# EAGLE design analog-daughter-as-built (EAGLE 6.6.0)
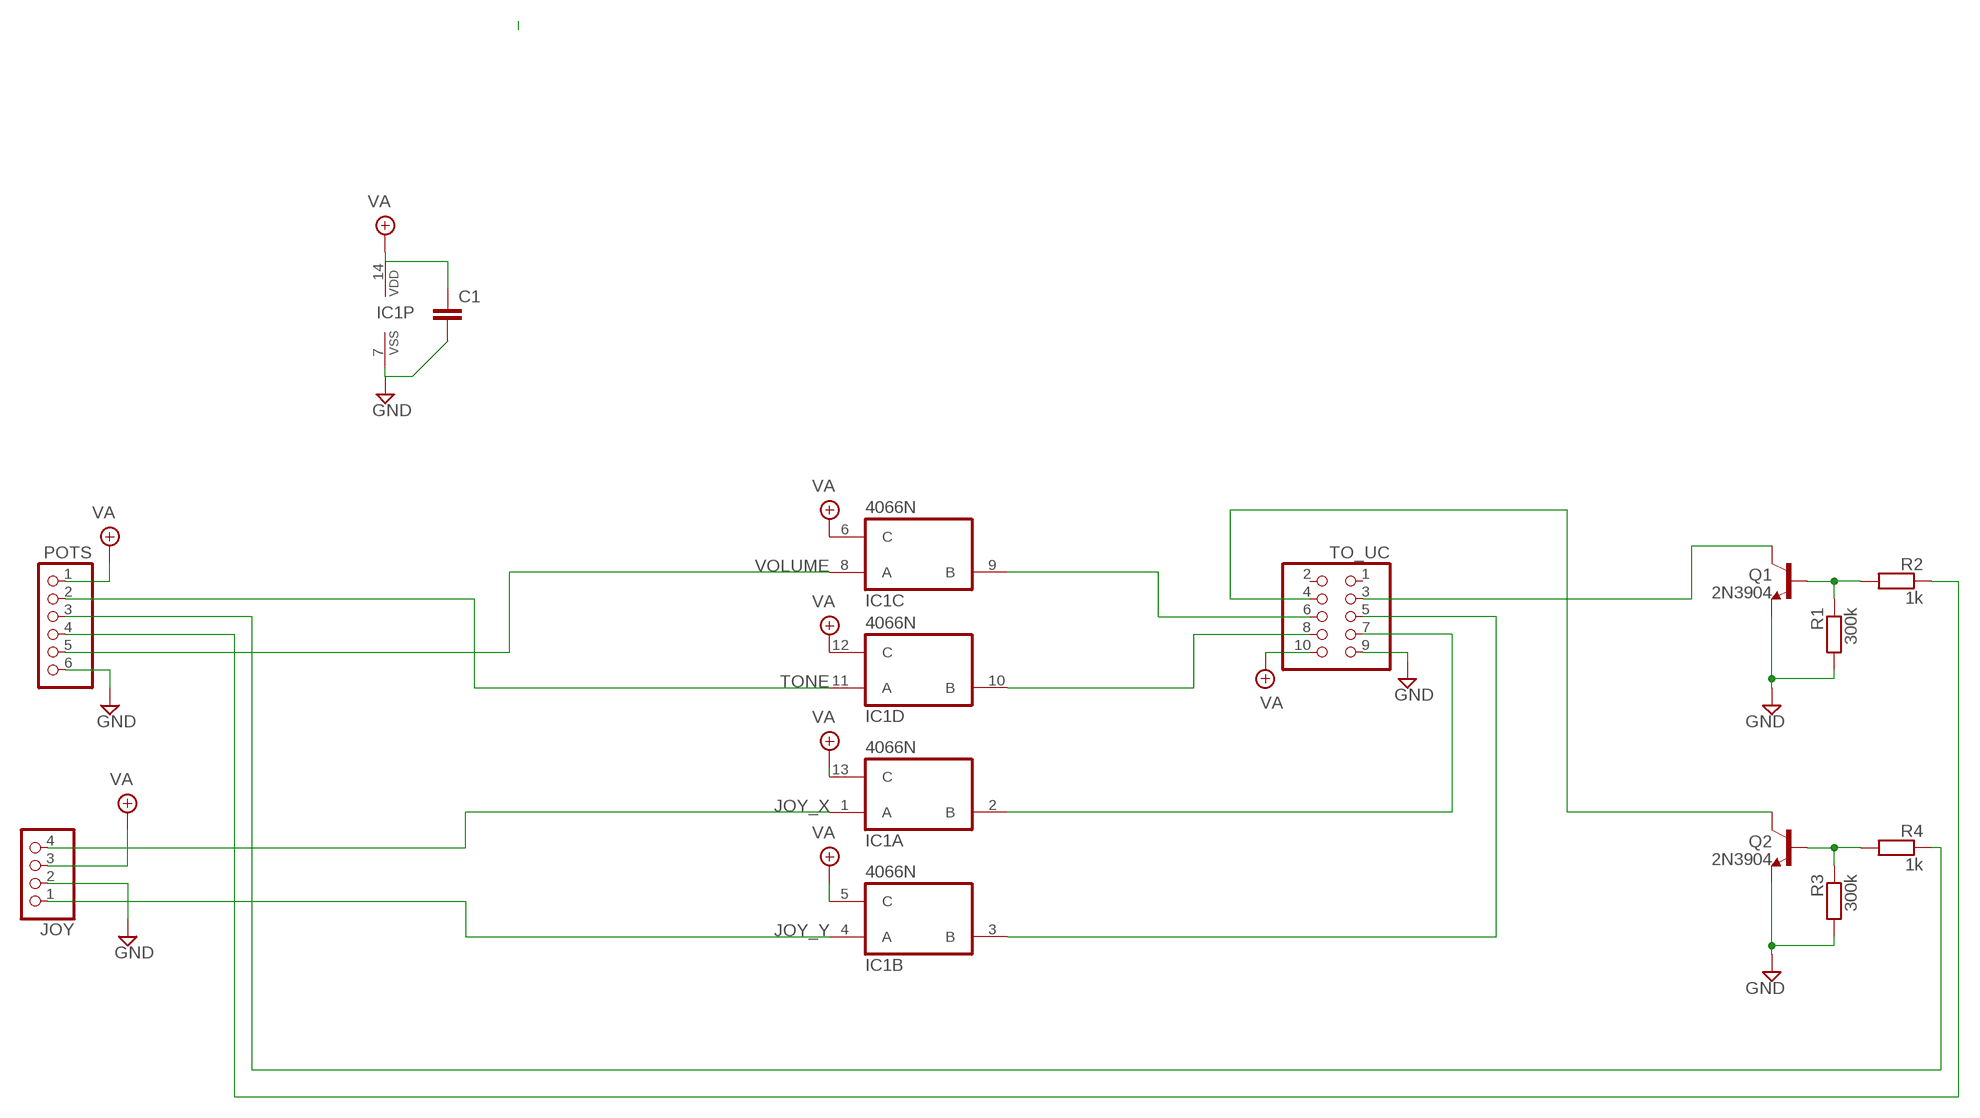
[diagram p0: schematic, sheet 1]

## Parts
C1  050X030_0251  [050X030_025]
IC1  4066N  [DIL14]
JOY  PINHD-1X4  [1X04]
POTS  PINHD-1X6  [1X06]
Q1  2N3904  [TO92-]
Q2  2N3904  [TO92-]
R1  300k  6MM-EU  [R0207/3]
R2  1k  6MM-EU  [R0207/3]
R3  300k  6MM-EU  [R0207/3]
R4  1k  6MM-EU  [R0207/3]
TO_UC  PINHD-2X5IDC  [10PIN_IDC]

## Nets
GND: C1.2 IC1.7(P:VSS) JOY.2 POTS.6 Q1.3(E) Q2.3(E) R1.2 R3.2 TO_UC.9
JOY_X: IC1.1(A:A) JOY.4
JOY_Y: IC1.4(B:A) JOY.1
N$2: Q1.1(C) TO_UC.3
N$3: IC1.9(C:B) TO_UC.6
N$4: IC1.10(D:B) TO_UC.8
N$5: IC1.2(A:B) TO_UC.7
N$6: IC1.3(B:B) TO_UC.5
N$9: Q2.1(C) TO_UC.4
N$11: Q1.2(B) R1.1 R2.2
N$12: Q2.2(B) R3.1 R4.2
TONE: IC1.11(D:A) POTS.2
TONE_BUTTON: POTS.3 R4.1
VA: C1.1 IC1.5(B:C) IC1.6(C:C) IC1.12(D:C) IC1.13(A:C) IC1.14(P:VDD) JOY.3 POTS.1 TO_UC.10
VOL_BUTTON: POTS.4 R2.1
VOLUME: IC1.8(C:A) POTS.5
Unconnected: TO_UC.1 TO_UC.2

## Library data of the parts
C1 = gm-caps-ceramic:050X030_025: 47 - 120pF Xicon Ceramic Disc 2.5mm lead spacing
IC1 = 40xx:4066: Quad bilateral ANALOG SWITCH
JOY = pinhead:PINHD-1X4: PIN HEADER
POTS = pinhead:PINHD-1X6: PIN HEADER
Q1 Q2 = gm-trans:2N3904: NPN Transistor
R1-R4 = gm-resistors:6MM-EU: 6mm Resistors (European schematic symbol) Leads spaced 1-6 holes apart for 0.1" perfboard. Suitable for 1/4 watt resistors.
TO_UC = jaapie:PINHD-2X5: PIN HEADER

## Board
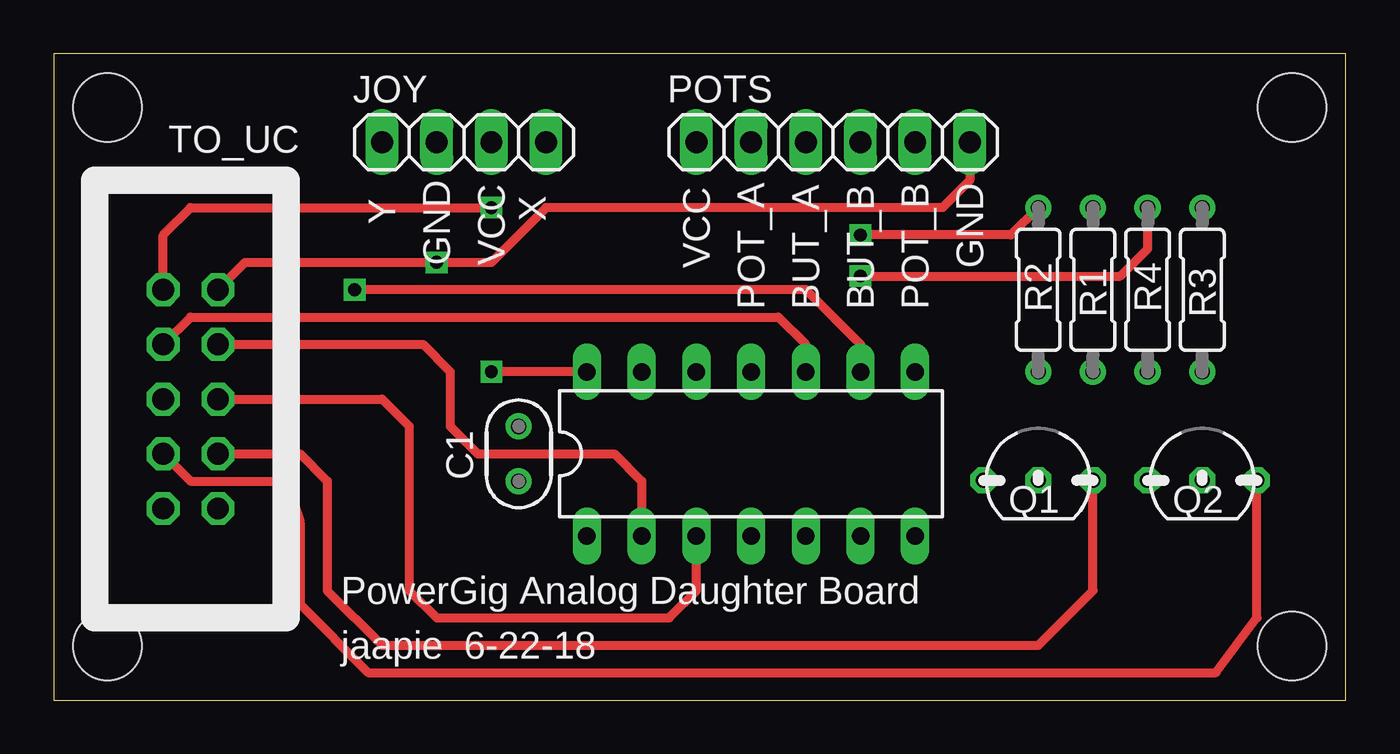
[diagram p1: board, top side]
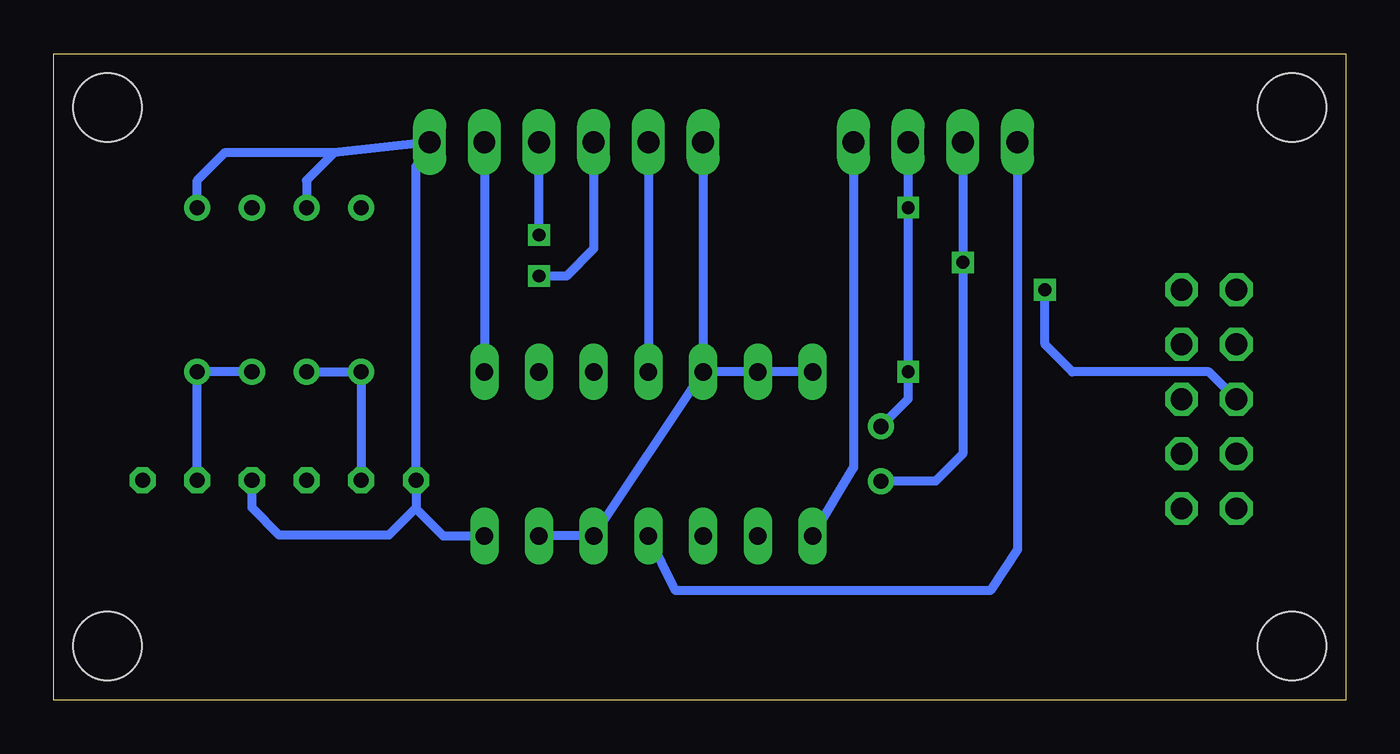
[diagram p2: board, bottom side, seen from below]

Size 60 x 30 mm. Coordinates in mm from the lower left corner, seen from the top.
Outline: 0,0 60,0 60,30 0,30 0,0
Copper layers (1*16): Top 0.035mm / dielectric 1.5mm / Bottom 0.035mm
Design rules "default": minimum track width 10mil, minimum drill 24mil, track to track 8mil, track to pad 8mil, pad to pad 8mil, via to via 8mil, smd to smd 8mil, copper to edge 40mil, drill to drill 8mil, minimum pad ring 10mil, minimum via ring 8mil, stop-mask expansion 4mil, vias tented up to drill 0mil, thermal gap 10mil
Holes 3.17 mm at 57.5,27.5 57.5,2.5 2.5,27.5 2.5,2.5

### Footprints (pad centres in the part's own frame; a part is rotated, then mirrored left to right if it is on the bottom)
050X030_025 = drill 0.7: 1 -1.27,0; 2 1.27,0
DIL14 = drill 0.813 long: 1 -7.62,-3.81; 2 -5.08,-3.81; 3 -2.54,-3.81; 4 0,-3.81; 5 2.54,-3.81; 6 5.08,-3.81; 7 7.62,-3.81; 8 7.62,3.81; 9 5.08,3.81; 10 2.54,3.81; 11 0,3.81; 12 -2.54,3.81; 13 -5.08,3.81; 14 -7.62,3.81
1X04 = drill 1.016 long: 1 -3.81,0; 2 -1.27,0; 3 1.27,0; 4 3.81,0
1X06 = drill 1.016 long: 1 -6.35,0; 2 -3.81,0; 3 -1.27,0; 4 1.27,0; 5 3.81,0; 6 6.35,0
TO92- = drill 0.7 octagon: 1 2.54,0; 2 0,0; 3 -2.54,0
R0207/3 = drill 0.7: 1 -3.81,0; 2 3.81,0
10PIN_IDC = drill 1.016 octagon: 1 -5.08,-1.27; 2 -5.08,1.27; 3 -2.54,-1.27; 4 -2.54,1.27; 5 0,-1.27; 6 0,1.27; 7 2.54,-1.27; 8 2.54,1.27; 9 5.08,-1.27; 10 5.08,1.27

### Placement (x,y rotation side)
C1  21.59,11.43 270 top
IC1  32.38,11.43 0 top
JOY  19.05,25.9 0 top
POTS  36.2,25.9 0 top
Q1  45.72,10.2 0 top
Q2  53.34,10.2 0 top
R1  48.26,19.05 90 top
R2  45.72,19.05 270 top
R3  53.34,19.05 90 top
R4  50.8,19.05 270 top
TO_UC  6.35,13.97 90 top

### Tracks (layer width: path | path; a pad name or v marks a point on that pad's centre or on a via)
GND  (via drill 0.6)
  Top 0.406: TO_UC.9 8.89,20.32 v17.78,20.32 20.32,20.32 22.86,22.86 41.27,22.86 42.55,24.13 POTS.6
  Bottom 0.406: JOY.2 v17.78,20.32 17.78,11.43 19.05,10.16 C1.2 | Q1.3 43.18,8.93 44.45,7.66 49.53,7.66 50.8,8.93 Q2.3 | Q1.3 43.18,8.89 41.91,7.62 IC1.7 | 46.99,25.4 POTS.6 43.18,24.77 Q1.3 | R1.2 48.26,24.13 46.99,25.4 | R3.2 53.34,24.13 52.07,25.4 46.99,25.4
JOY_X
  Bottom 0.406: JOY.4 22.86,10.79 IC1.1
JOY_Y
  Bottom 0.406: JOY.1 15.24,6.99 16.51,5.08 31.11,5.08 IC1.4
N$2
  Top 0.406: TO_UC.3 11.43,11.43 12.7,10.16 12.7,5.08 15.24,2.54 45.72,2.54 48.26,5.08 Q1.1
N$3  (via drill 0.6)
  Top 0.406: IC1.9 37.47,16.51 34.92,19.05 v13.97,19.05
  Bottom 0.406: TO_UC.6 6.35,15.24 12.7,15.24 13.97,16.51 v13.97,19.05
N$4
  Top 0.406: TO_UC.8 6.35,17.78 33.66,17.78 34.92,16.51 IC1.10
N$5
  Top 0.406: TO_UC.7 17.14,16.51 18.41,15.24 18.41,12.7 19.68,11.43 26.04,11.43 27.3,10.16 IC1.2
N$6
  Top 0.406: TO_UC.5 15.24,13.97 16.51,12.7 16.51,5.08 17.78,3.81 28.57,3.81 29.84,5.08 IC1.3
N$9
  Top 0.406: TO_UC.4 6.35,10.16 10.79,10.16 11.43,8.26 11.43,4.45 14.61,1.27 53.98,1.27 55.88,3.81 Q2.1
N$11
  Bottom 0.406: Q1.2 R2.2 R1.1
N$12
  Bottom 0.406: Q2.2 R3.1 R4.2
TONE
  Bottom 0.406: POTS.2 IC1.11
TONE_BUTTON  (via drill 0.6)
  Top 0.406: v37.47,19.68 49.53,19.68 50.8,20.95 R4.1
  Bottom 0.406: POTS.3 34.92,20.95 36.2,19.68 v37.47,19.68
VA  (via drill 0.6)
  Top 0.406: IC1.14 v20.32,15.24 | TO_UC.10 5.08,21.59 6.35,22.86 v20.32,22.86
  Bottom 0.406: IC1.14 IC1.13 IC1.12 | IC1.6 IC1.5 IC1.12 | POTS.1 IC1.12 | JOY.3 v20.32,22.86 v20.32,15.24 20.32,13.97 C1.1
VOL_BUTTON  (via drill 0.6)
  Top 0.406: R2.1 44.45,21.59 v37.47,21.59
  Bottom 0.406: v37.47,21.59 POTS.4
VOLUME
  Bottom 0.406: POTS.5 IC1.8

### Text on the board
tNames: Y | X | GND | VCC | VCC | GND | POT_A | BUT_A | BUT_B | POT_B | PowerGig Analog Daughter Board | jaapie 6-22-18